# Altium schematic sheet Power.SchDoc
size A
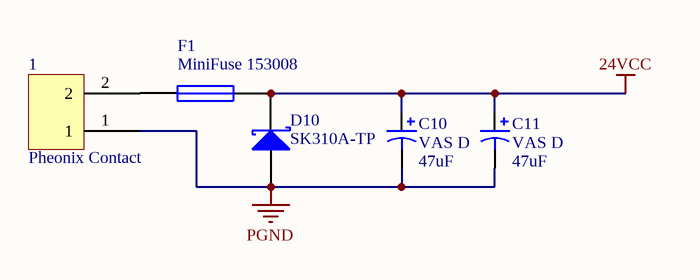
[diagram p0: Power.SchDoc]

## Parts
1  Pheonix Contact  [con-phoenix-508]
C10  VAS D  value 47uF  [Panasonic VS D]
C11  VAS D  value 47uF  [Panasonic VS D]
D10  SK310A-TP  [SK310A-TP]
F1  MiniFuse 153008  [TinyFuseATO_Carrier]

## Nets
24VCC: C10.1 C11.1 D10.2(K) F1.2
PGND: 1.1 C10.2 C11.2 D10.1(A)
Net1_2: 1.2 F1.1

## Library data of the parts
1 = Pheonix Contact 2X1
C10 C11 = Cap Pol1: Polarized Capacitor (Radial); Published: 8-Jun-2000; LatestRevisionDate: 17-Jul-2002; LatestRevisionNote: Re-released for DXP Platform.; PackageReference: RB7.6-15; Publisher: Altium Limited; PackageDescription: Polarized Capacitor (Radial); 2 Leads
D10 = D Schottky: Schottky Diode; Published: 8-Jun-2000; LatestRevisionDate: 17-Jul-2002; LatestRevisionNote: Re-released for DXP Platform.; PackageReference: SMB; Publisher: Altium Limited; PackageDescription: DO-214-AA/SMB; 2 C-Bend Leads; Body 5.3 x 3.6 mm, inc. leads (LxW); Code_JEDEC: DO-214-AA
F1 = Fuse 1: Fuse; Published: 8-Jun-2000; LatestRevisionDate: 17-Jul-2002; LatestRevisionNote: Re-released for DXP Platform.; PackageReference: PIN-W2/E2.8; Publisher: Altium Limited; PackageDescription: Thru-Hole; 2 Leads